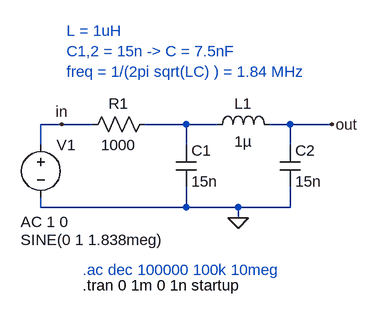
[diagram p0: schematic l_double_c.asc]
l_double_c.asc, the LTspice schematic file:
Version 4
SHEET 1 1104 680
WIRE -128 96 -160 96
WIRE -80 96 -128 96
WIRE 64 96 0 96
WIRE 112 96 64 96
WIRE 224 96 192 96
WIRE 288 96 224 96
WIRE -160 128 -160 96
WIRE 64 128 64 96
WIRE 224 128 224 96
WIRE -160 224 -160 208
WIRE 64 224 64 192
WIRE 64 224 -160 224
WIRE 144 224 64 224
WIRE 224 224 224 192
WIRE 224 224 144 224
WIRE 144 240 144 224
FLAG 144 240 0
FLAG -128 96 in
FLAG 288 96 out
SYMBOL ind 96 112 R270
WINDOW 0 32 56 VTop 2
WINDOW 3 5 56 VBottom 2
SYMATTR InstName L1
SYMATTR Value 1µ
SYMATTR SpiceLine Rser=0.001m
SYMBOL cap 48 128 R0
SYMATTR InstName C1
SYMATTR Value 15n
SYMBOL cap 208 128 R0
SYMATTR InstName C2
SYMATTR Value 15n
SYMBOL voltage -160 112 R0
WINDOW 3 -31 162 Left 2
WINDOW 123 -31 134 Left 2
WINDOW 39 -31 190 Left 2
SYMATTR InstName V1
SYMATTR Value SINE(0 1 1.838meg)
SYMATTR Value2 AC 1 0
SYMBOL res 16 80 R90
WINDOW 0 0 56 VBottom 2
WINDOW 3 32 56 VTop 2
SYMATTR InstName R1
SYMATTR Value 1000
TEXT -96 320 Left 2 ;.ac dec 100000 100k 10meg
TEXT -120 -48 Left 2 ;L = 1uH\nC1,2 = 15n -> C = 7.5nF\nfreq = 1/(2pi sqrt(LC) ) = 1.84 MHz
TEXT -96 344 Left 2 !.tran 0 1m 0 1n startup

The netlist it stands for:
* l_double_c.asc
L1 N001 out 1µ Rser=0.001m
C1 N001 0 15n
C2 out 0 15n
V1 in 0 SINE(0 1 1.838meg) AC 1 0
R1 N001 in 1000
* .ac dec 100000 100k 10meg
* L = 1uH
* C1,2 = 15n -> C = 7.5nF
* freq = 1/(2pi sqrt(LC) ) = 1.84 MHz
.tran 0 1m 0 1n startup
.backanno
.end